# EAGLE schematic nrf52832_E73_breakout_rev_1 (EAGLE 9.1.3)
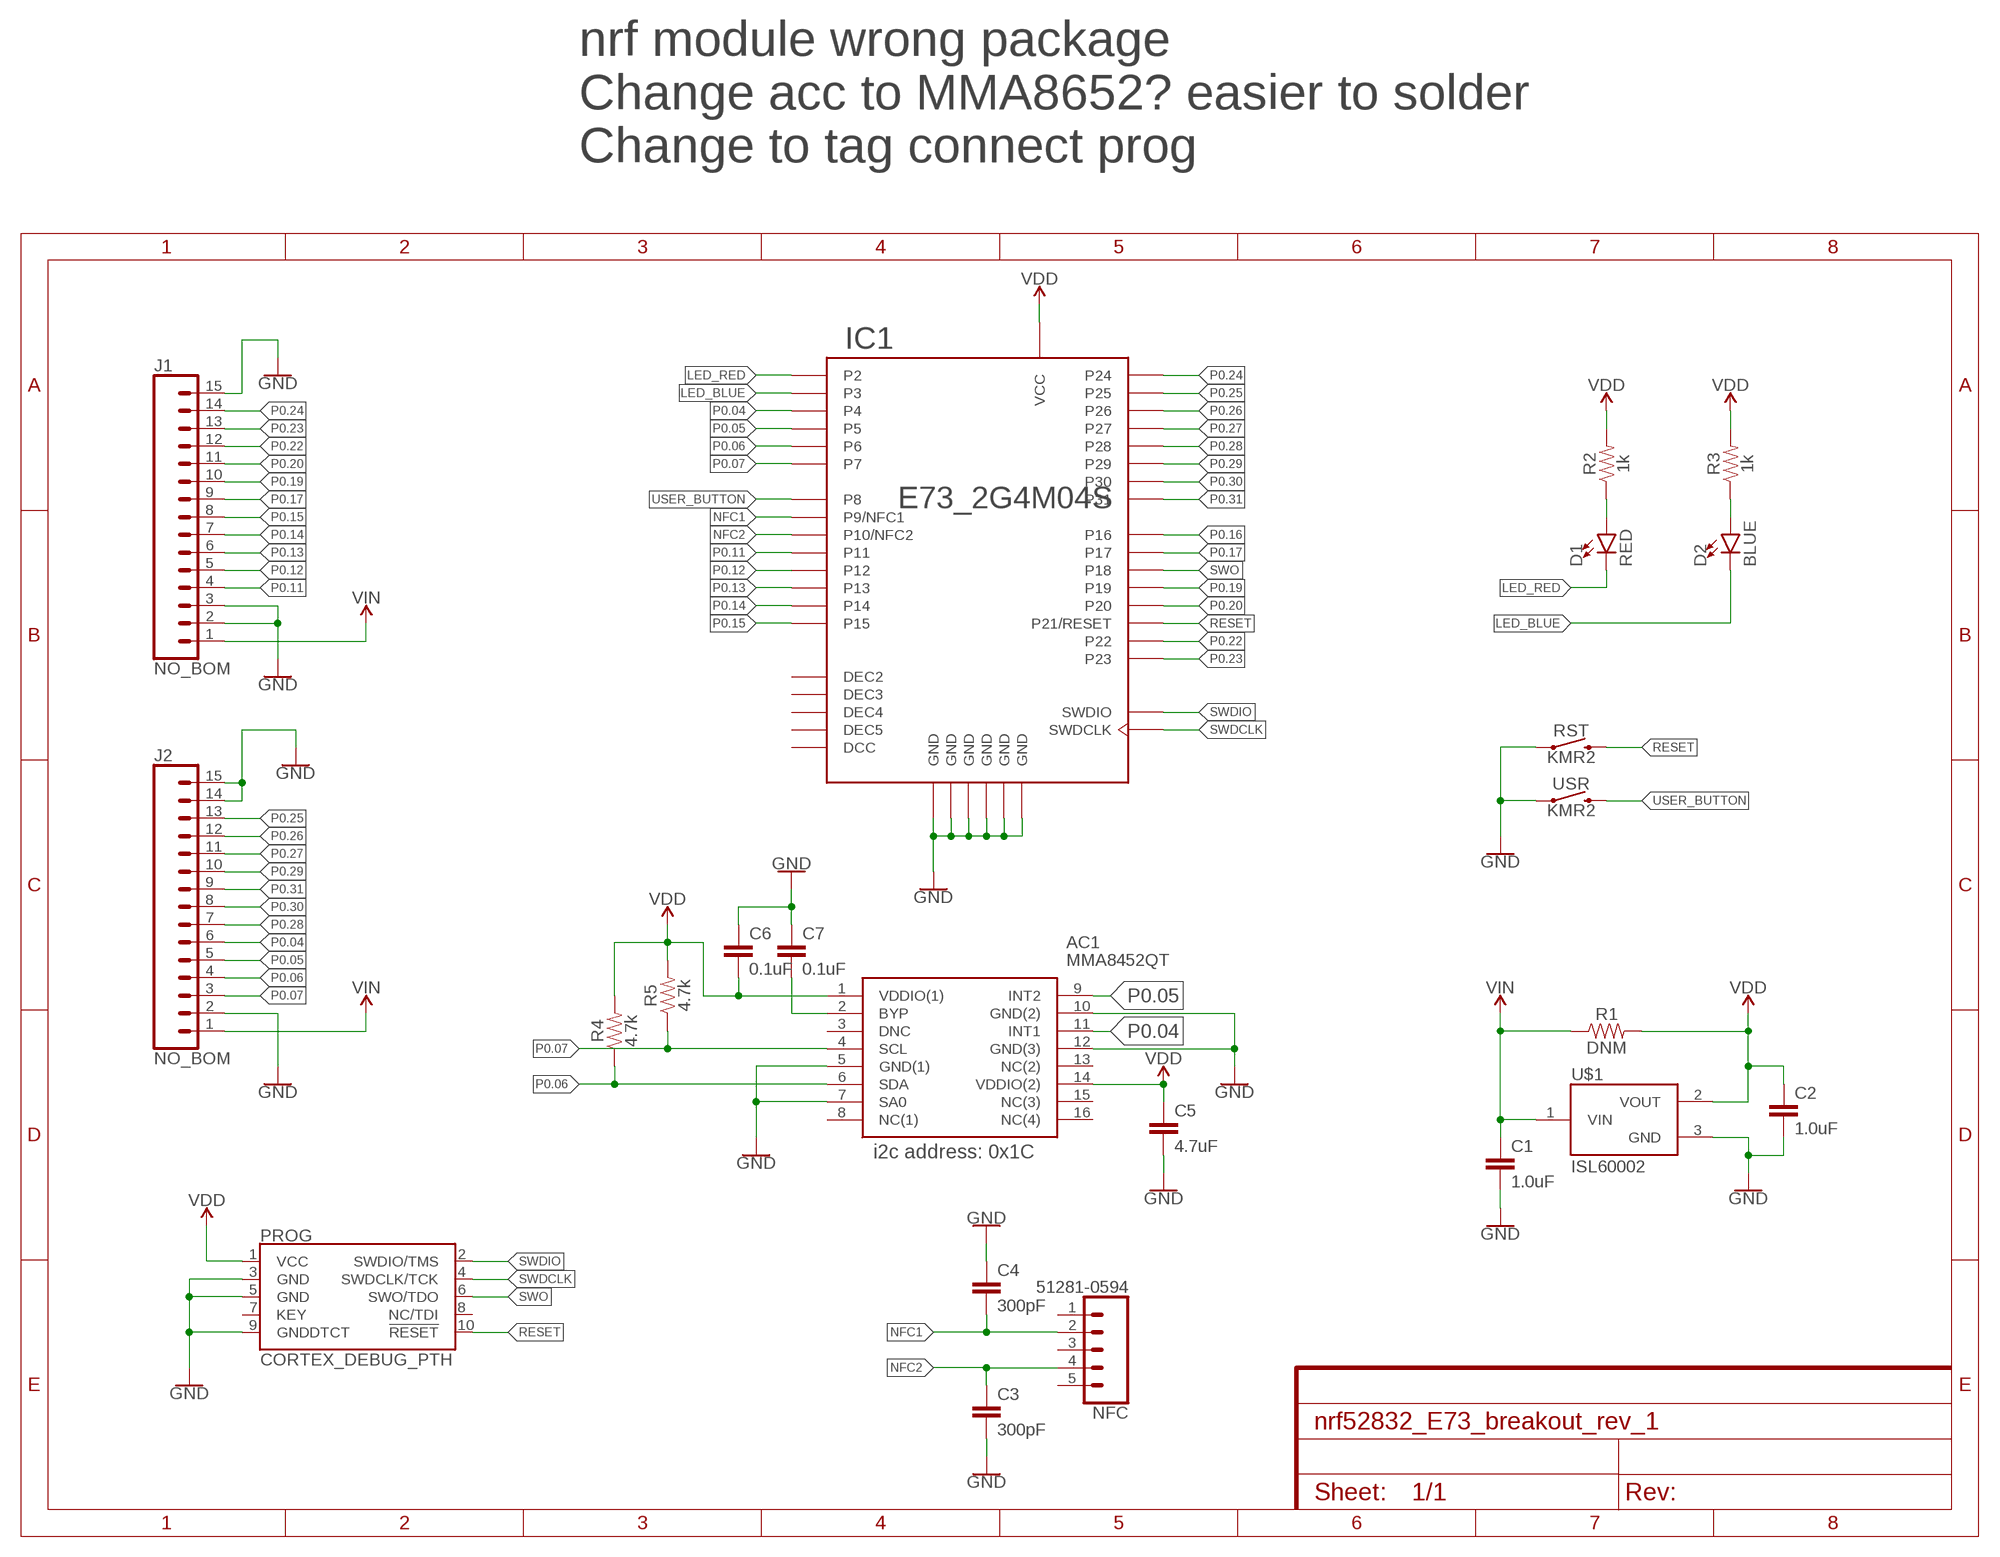
[diagram p0: schematic, sheet 1]

## Parts
AC1  MMA8452QT  [PQFN50P300X300X100-16N]
C1  1.0uF  CAP-16V-20%-0603  [C0603]
C2  1.0uF  CAP-6.3V-20%-0603  [C0603]
C3  300pF  CAP-6.3V-20%-0402  [C0402]
C4  300pF  CAP-6.3V-20%-0402  [C0402]
C5  4.7uF  CAP-6.3V-20%-0603  [C0603]
C6  0.1uF  CAP-6.3V-20%-0402  [C0402]
C7  0.1uF  CAP-6.3V-20%-0402  [C0402]
D1  RED  LED0603  [LED-0603]
D2  BLUE  LED0603  [LED-0603]
IC1  E73_2G4M04S  [E73_2G4M04S]
J1  NO_BOM  CONN_15  [1X15]
J2  NO_BOM  CONN_15  [1X15]
NFC  51281-0594  [51281-0594]
PROG  CORTEX_DEBUG_PTH  [2X5-PTH-1.27MM]
R1  DNM  RES-0.063W-5%-0603  [R0603]
R2  1k  RES-0.063W-5%-0603  [R0603]
R3  1k  RES-0.063W-5%-0603  [R0603]
R4  4.7k  RES-0.063W-5%-0402  [R0402]
R5  4.7k  RES-0.063W-5%-0402  [R0402]
RST  KMR2  [TACTILE_SWITCH_SMD_4.6X2.8MM]
U$1  ISL60002  [SOT23-3]
USR  KMR2  [TACTILE_SWITCH_SMD_4.6X2.8MM]

## Nets
GND: AC1.5(GND(1)) AC1.7(SA0) AC1.10(GND(2)) AC1.12(GND(3)) C1.2 C2.2 C3.2 C4.1 C5.2 C6.1 C7.1 IC1.0(GND) IC1.1(GND) IC1.2(GND) IC1.15(GND) IC1.42(GND) IC1.43(GND) J1.2 J1.3 J1.15 J2.2 J2.14 J2.15 PROG.3(GND) PROG.5(GND) PROG.9(GNDDTCT) RST.1 RST.2 U$1.3(GND) USR.1 USR.2
LED_BLUE: D2.C IC1.18(P3)
LED_RED: D1.C IC1.17(P2)
N$1: D2.A R3.1
N$2: D1.A R2.1
N$6: AC1.2(BYP) C7.2
NFC1: C4.2 IC1.24(P9/NFC1) NFC.2
NFC2: C3.1 IC1.25(P10/NFC2) NFC.4
P0.04: AC1.11(INT1) IC1.19(P4) J2.6
P0.05: AC1.9(INT2) IC1.20(P5) J2.5
P0.06: AC1.6(SDA) IC1.21(P6) J2.4 R4.1
P0.07: AC1.4(SCL) IC1.22(P7) J2.3 R5.1
P0.11: IC1.26(P11) J1.4
P0.12: IC1.27(P12) J1.5
P0.13: IC1.28(P13) J1.6
P0.14: IC1.29(P14) J1.7
P0.15: IC1.30(P15) J1.8
P0.16: IC1.31(P16)
P0.17: IC1.32(P17) J1.9
P0.19: IC1.34(P19) J1.10
P0.20: IC1.35(P20) J1.11
P0.22: IC1.39(P22) J1.12
P0.23: IC1.40(P23) J1.13
P0.24: IC1.41(P24) J1.14
P0.25: IC1.5(P25) J2.13
P0.26: IC1.6(P26) J2.12
P0.27: IC1.7(P27) J2.11
P0.28: IC1.8(P28) J2.7
P0.29: IC1.9(P29) J2.10
P0.30: IC1.10(P30) J2.8
P0.31: IC1.11(P31) J2.9
RESET: IC1.36(P21/RESET) PROG.10(!RESET) RST.3 RST.4
SWDCLK: IC1.37(SWDCLK) PROG.4(SWDCLK/TCK)
SWDIO: IC1.38(SWDIO) PROG.2(SWDIO/TMS)
SWO: IC1.33(P18) PROG.6(SWO/TDO)
USER_BUTTON: IC1.23(P8) USR.3 USR.4
VDD: AC1.1(VDDIO(1)) AC1.14(VDDIO(2)) C2.1 C5.1 C6.2 IC1.16(VCC) PROG.1(VCC) R1.2 R2.2 R3.2 R4.2 R5.2 U$1.2(VOUT)
VIN: C1.1 J1.1 J2.1 R1.1 U$1.1(VIN)
Unconnected: AC1.3(DNC) AC1.8(NC(1)) AC1.13(NC(2)) AC1.15(NC(3)) AC1.16(NC(4)) NFC.1 NFC.3 NFC.5 PROG.7(KEY) PROG.8(NC/TDI)

## Notes on the sheet
- nrf module wrong package
  Change acc to MMA8652? easier to solder
  Change to tag connect prog
- i2c address: 0x1C

## Power pins joined to a net without a drawn wire
DCC: IC1.13(DCC)
DEC2: IC1.3(DEC2)
DEC3: IC1.4(DEC3)
DEC4: IC1.12(DEC4)
DEC5: IC1.14(DEC5)

## Library data of the parts
AC1 = Inventas-IC:MMA8452QT: Accelerometers LOW G 3-AXIS 12BT EX VLT Source: Datasheet <http://docs-europe.electrocomponents.com/webdocs/12de/0900766b812de994.pdf>; DESCRIPTION: Accelerometers LOW G 3-AXIS 12BT EX VLT; HEIGHT: 1mm; MANUFACTURER_NAME: Nexperia; MANUFACTURER_PART_NUMBER: MMA8452QT; RS_PART_NUMBER: 9227526; SUPPLIER_NAME: RS
C1 = Inventas-Passives:CAP-16V-20%: Ceramic capacitors
C2-C7 = Inventas-Passives:CAP-6.3V-20%: Ceramic capacitors
D1 D2 = inventas_LEDs:LED: LED (Generic) Standard schematic elements and footprints for 5mm, 3mm, 1206, and 0603 sized LEDs. Generic LEDs with no color specified.
IC1 = Inventas-IC:E73_2G4M04S
J1 J2 = SparkFun-Connectors:CONN_15: Multi connection point. Often used as Generic Header-pin footprint for 0.1 inch spaced/style header connections On any of the 0.1 inch spaced packages, you can populate with these: Break Away Headers - Straight <https://www.sparkfun.com/products/116> (PRT-00116) Break Away Male Headers - Right Angle <https://www.sparkfun.com/products/553> (PRT-00553) Female Headers <https://www.sparkfun.com/products/115> (PRT-00115) Break Away Headers - Machine Pin <https://www.sparkfun.com/products/117> (PRT-00117) Break Away Female Headers - Swiss Machine Pin <https://www.sparkfun.com/products/743> (PRT-00743) For SCREWTERMINALS and SPRING TERMINALS visit here: Screw Terimnals on SparkFun.com <https://www.sparkfun.com/search/results?term=Screw+Terminals> (5mm/3.5mm/2.54mm spacing) This device is also useful as a general connection point to wire up your design to another part of your project. Our various solder wires solder well into these plated through hole pads. Hook-Up Wire - Assortment (Stranded, 22 AWG) <https://www.sparkfun.com/products/11375> (PRT-11375) Hook-Up Wire - Assortment (Solid Core, 22 AWG) <https://www.sparkfun.com/products/11367> (PRT-11367) View the entire wire category on our website here <https://www.sparkfun.com/categories/141> Special notes: Molex polarized connector foot print use with SKU : PRT-08231 with associated crimp pins and housings. 1MM SMD Version SKU: PRT-10208 NOTES ON THE VARIANTS LOCK and LOCK_LONGPADS... This footprint was designed to help hold the alignment of a through-hole component (i.e. 6-pin header) while soldering it into place. You may notice that each hole has been shifted either up or down by 0.005 of an inch from it's more standard position (which is a perfectly straight line). This slight alteration caused the pins (the squares in the middle) to touch the edges of the holes. Because they are alternating, it causes a "brace" to hold the component in place. 0.005 has proven to be the perfect amount of "off-center" position when using our standard breakaway headers. Although looks a little odd when you look at the bare footprint, once you have a header in there, the alteration is very hard to notice. Also,if you push a header all the way into place, it is covered up entirely on the bottom side.
NFC = Inventas-Connectors:51281-0594: FFC & FPC Connectors 0.5 FPC Non-ZIF 5Ckt Dual Contact Source: Datasheet <http://www.molex.com/pdm_docs/sd/512810594_sd.pdf>; DESCRIPTION: FFC & FPC Connectors 0.5 FPC Non-ZIF 5Ckt Dual Contact; HEIGHT: mm; MANUFACTURER_NAME: Molex; MANUFACTURER_PART_NUMBER: 51281-0594; SUPPLIER_NAME: RS
PROG = Inventas-Connectors:CORTEX_DEBUG: Cortex Debug Connector - 10 pin Supports JTAG debug, Serial Wire debug, and Serial Wire Viewer. PTH and SMD connector options available. General Connector Information <http://infocenter.arm.com/help/topic/com.arm.doc.faqs/attached/13634/cortex_debug_connectors.pdf> Products: PTH Connector <http://www.digikey.com/product-detail/en/cnc-tech/3220-10-0100-00/1175-1627-ND/3883661> -via Digi-Key SparkFun PSoc <https://www.sparkfun.com/products/13229> SparkFun T <https://www.sparkfun.com/products/13810>
R1-R5 = Inventas-Passives:RES-0.063W-5%-: Generic Resistor Package
RST USR = Inventas-Buttons:KMR2; MANUFACTURER_NAME: C&K; MANUFACTURER_PART_NUMBER: KMR211GLFS
U$1 = Inventas-Power:ISL60002